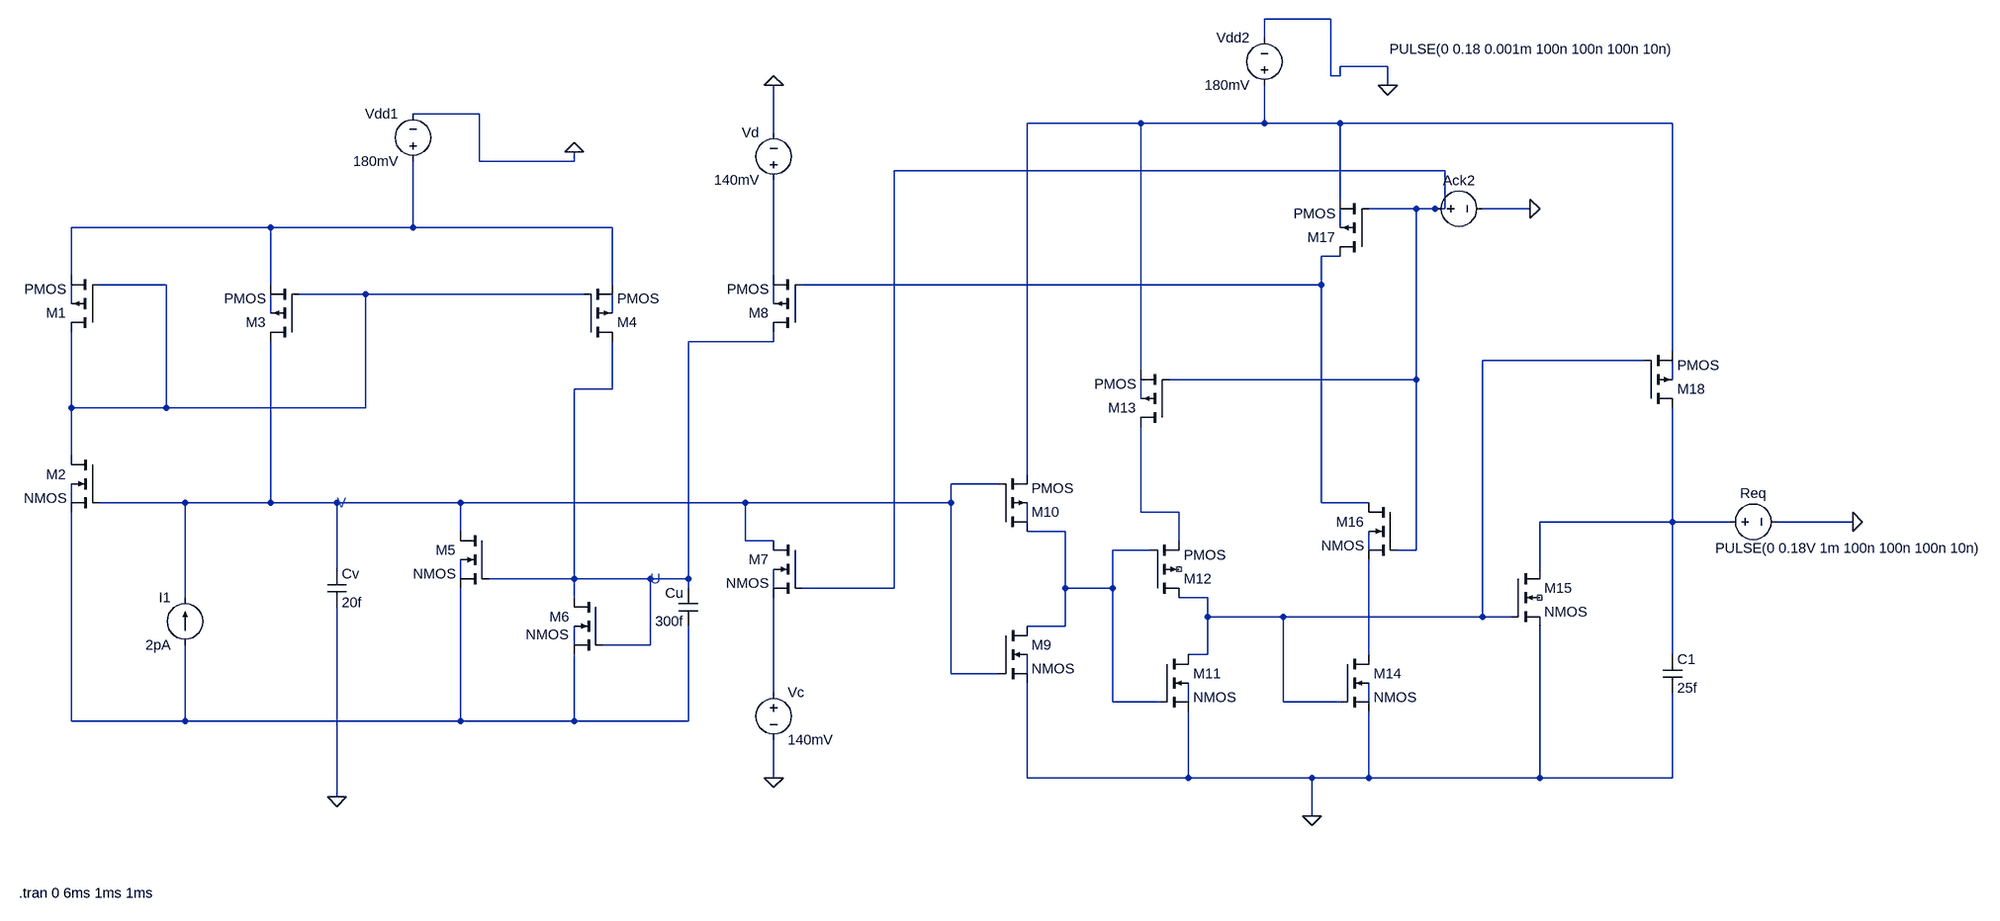
[diagram p0: schematic izhikevich_neurontemplatetest10.asc]
izhikevich_neurontemplatetest10.asc, the LTspice schematic file:
Version 4.1
SHEET 1 2428 1304
WIRE 1280 -240 1168 -240
WIRE 1168 -208 1168 -240
WIRE 1376 -160 1296 -160
WIRE 1280 -144 1280 -240
WIRE 1296 -144 1296 -160
WIRE 1296 -144 1280 -144
WIRE 1376 -128 1376 -160
WIRE -160 -80 -272 -80
WIRE 960 -64 768 -64
WIRE 1168 -64 1168 -128
WIRE 1168 -64 960 -64
WIRE 1296 -64 1168 -64
WIRE 1856 -64 1296 -64
WIRE 336 -48 336 -128
WIRE -160 0 -160 -80
WIRE 0 0 0 -16
WIRE 0 0 -160 0
WIRE 1472 16 544 16
WIRE 1296 64 1296 -64
WIRE 1424 80 1344 80
WIRE 1456 80 1424 80
WIRE 1472 80 1472 16
WIRE 1472 80 1456 80
WIRE 1616 80 1536 80
WIRE -512 112 -848 112
WIRE -272 112 -272 0
WIRE -272 112 -512 112
WIRE 64 112 -272 112
WIRE 1296 112 1296 80
WIRE 1296 160 1264 160
WIRE -848 192 -848 112
WIRE 336 192 336 32
WIRE -688 208 -800 208
WIRE -512 208 -512 112
WIRE 64 208 64 112
WIRE 1264 208 1264 160
WIRE 1264 208 384 208
WIRE -352 224 -464 224
WIRE 16 224 -352 224
WIRE -848 240 -848 208
WIRE 336 240 336 208
WIRE -512 256 -512 224
WIRE 64 256 64 224
WIRE 336 304 336 288
WIRE 336 304 192 304
WIRE 1856 320 1856 -64
WIRE 1808 336 1536 336
WIRE 960 352 960 -64
WIRE 1424 368 1424 80
WIRE 1424 368 1008 368
WIRE 1856 368 1856 336
WIRE 64 384 64 304
WIRE 64 384 0 384
WIRE 960 400 960 368
WIRE -848 416 -848 288
WIRE -688 416 -688 208
WIRE -688 416 -848 416
WIRE -352 416 -352 224
WIRE -352 416 -688 416
WIRE -848 496 -848 416
WIRE 768 528 768 -64
WIRE 720 544 640 544
WIRE -848 576 -848 544
WIRE -656 576 -800 576
WIRE -512 576 -512 304
WIRE -512 576 -656 576
WIRE -400 576 -512 576
WIRE -192 576 -400 576
WIRE 288 576 -192 576
WIRE 640 576 640 544
WIRE 640 576 288 576
WIRE 1264 576 1264 208
WIRE 1344 576 1264 576
WIRE 960 592 960 448
WIRE 1024 592 960 592
WIRE 768 608 768 576
WIRE 1856 608 1856 416
WIRE 1856 608 1632 608
WIRE 1952 608 1856 608
WIRE 2160 608 2032 608
WIRE -192 624 -192 576
WIRE 832 624 768 624
WIRE 288 640 288 576
WIRE 336 640 288 640
WIRE 1024 640 1024 592
WIRE 976 656 912 656
WIRE 1344 656 1344 624
WIRE 1424 656 1424 368
WIRE 1424 656 1392 656
WIRE -400 688 -400 576
WIRE 1632 688 1632 608
WIRE -192 704 -192 672
WIRE 0 704 0 384
WIRE 0 704 -144 704
WIRE 128 704 0 704
WIRE 192 704 192 304
WIRE 192 704 128 704
WIRE 192 720 192 704
WIRE 336 720 336 688
WIRE 544 720 544 16
WIRE 544 720 384 720
WIRE 832 720 832 624
WIRE 912 720 912 656
WIRE 912 720 832 720
WIRE -656 736 -656 576
WIRE 0 736 0 704
WIRE 1072 736 1024 736
WIRE 1072 768 1072 736
WIRE 1200 768 1072 768
WIRE 1536 768 1536 336
WIRE 1536 768 1200 768
WIRE 1584 768 1536 768
WIRE 832 784 832 720
WIRE 832 784 768 784
WIRE 0 816 0 784
WIRE 128 816 128 704
WIRE 128 816 48 816
WIRE 1072 832 1072 768
WIRE 1072 832 1040 832
WIRE 1344 832 1344 672
WIRE 1856 832 1856 608
WIRE 640 864 640 576
WIRE 720 864 640 864
WIRE 768 864 768 832
WIRE 336 896 336 736
WIRE 912 912 912 720
WIRE 992 912 912 912
WIRE 1040 912 1040 880
WIRE 1200 912 1200 768
WIRE 1296 912 1200 912
WIRE 1344 912 1344 880
WIRE -848 944 -848 592
WIRE -656 944 -656 816
WIRE -656 944 -848 944
WIRE -192 944 -192 720
WIRE -192 944 -656 944
WIRE 0 944 0 832
WIRE 0 944 -192 944
WIRE 192 944 192 784
WIRE 192 944 0 944
WIRE 336 1040 336 976
WIRE 768 1040 768 880
WIRE 1040 1040 1040 928
WIRE 1040 1040 768 1040
WIRE 1248 1040 1040 1040
WIRE 1344 1040 1344 928
WIRE 1344 1040 1248 1040
WIRE 1632 1040 1632 784
WIRE 1632 1040 1344 1040
WIRE 1856 1040 1856 896
WIRE 1856 1040 1632 1040
WIRE -400 1072 -400 752
WIRE 1248 1104 1248 1040
FLAG 0 -16 0
FLAG 336 -128 0
FLAG 1376 -128 0
FLAG 2160 608 0
FLAG 336 1040 0
FLAG -400 1072 0
FLAG 1248 1104 0
FLAG 1616 80 0
SYMBOL voltage 336 880 R0
WINDOW 123 0 0 Left 0
WINDOW 39 0 0 Left 0
SYMATTR InstName Vc
SYMATTR Value 140mV
SYMBOL current -656 816 R180
WINDOW 0 24 80 Left 2
WINDOW 3 24 0 Left 2
WINDOW 123 0 0 Left 0
WINDOW 39 0 0 Left 0
SYMATTR InstName I1
SYMATTR Value 2pA
SYMBOL voltage -272 16 R180
WINDOW 0 24 96 Left 2
WINDOW 3 24 16 Left 2
WINDOW 123 0 0 Left 0
WINDOW 39 0 0 Left 0
SYMATTR InstName Vdd1
SYMATTR Value 180mV
SYMBOL voltage 1168 -112 R180
WINDOW 0 24 96 Left 2
WINDOW 3 24 16 Left 2
WINDOW 123 0 0 Left 0
WINDOW 39 0 0 Left 0
SYMATTR InstName Vdd2
SYMATTR Value 180mV
SYMBOL voltage 336 48 R180
WINDOW 0 24 96 Left 2
WINDOW 3 24 16 Left 2
WINDOW 123 0 0 Left 0
WINDOW 39 0 0 Left 0
SYMATTR InstName Vd
SYMATTR Value 140mV
SYMBOL cap 208 720 M0
SYMATTR InstName Cu
SYMATTR Value 300f
SYMBOL cap -416 688 R0
SYMATTR InstName Cv
SYMATTR Value 20f
SYMBOL cap 1840 832 R0
SYMATTR InstName C1
SYMATTR Value 25f
SYMBOL voltage 1936 608 R270
WINDOW 0 32 56 VTop 2
WINDOW 3 -29 216 VBottom 2
WINDOW 123 0 0 Left 0
WINDOW 39 0 0 Left 0
SYMATTR InstName Req
SYMATTR Value PULSE(0 0.18V 1m 100n 100n 100n 10n)
SYMBOL voltage 1440 80 R270
WINDOW 0 32 56 VTop 2
WINDOW 3 285 179 VBottom 2
WINDOW 123 0 0 Left 0
WINDOW 39 0 0 Left 0
SYMATTR InstName Ack2
SYMATTR Value PULSE(0 0.18 0.001m 100n 100n 100n 10n)
SYMBOL nmos4 384 640 M0
SYMATTR InstName M7
SYMATTR Value2 l=175n w=350n
SYMBOL nmos4 48 736 M0
WINDOW 3 58 62 Left 2
SYMATTR InstName M6
SYMATTR Value2 l=700n w=150n
SYMBOL nmos4 -144 624 M0
SYMATTR InstName M5
SYMATTR Value2 l=400n w=600n
SYMBOL nmos4 -800 496 M0
SYMATTR InstName M2
SYMATTR Value2 l=300n w=125n
SYMBOL pmos4 1008 448 R180
SYMATTR InstName M13
SYMATTR Value2 l=200n w=100n
SYMBOL pmos4 384 288 R180
SYMATTR InstName M8
SYMATTR Value2 l=1.3u w=125n
SYMBOL pmos4 16 304 M180
SYMATTR InstName M4
SYMATTR Value2 l=650n w=90n
SYMBOL pmos4 -464 304 R180
SYMATTR InstName M3
SYMATTR Value2 l=300n w=125n
SYMBOL pmos4 -800 288 R180
SYMATTR InstName M1
SYMATTR Value2 l=300n w=125n
SYMBOL pmos4 720 624 M180
SYMATTR InstName M10
SYMATTR Value2 l=1u w=100n
SYMBOL pmos4 976 736 M180
SYMATTR InstName M12
SYMATTR Value2 l=100n w=100n
SYMBOL pmos4 1808 416 M180
SYMATTR InstName M18
SYMATTR Value2 l=200n w=100n
SYMBOL nmos4 720 784 R0
SYMATTR InstName M9
SYMATTR Value2 l=100n w=100n
SYMBOL nmos4 992 832 R0
SYMATTR InstName M11
SYMATTR Value2 l=1u w=100n
SYMBOL pmos4 1344 160 R180
SYMATTR InstName M17
SYMATTR Value2 l=100n w=100n
SYMBOL nmos4 1392 576 M0
SYMATTR InstName M16
SYMATTR Value2 l=100n w=100n
SYMBOL nmos4 1296 832 R0
SYMATTR InstName M14
SYMATTR Value2 l=100n w=100n
SYMBOL nmos4 1584 688 R0
SYMATTR InstName M15
SYMATTR Value2 l=100n w=250n
TEXT 128 704 Left 2 ;U
TEXT -400 576 Left 2 ;V
TEXT -936 1256 Left 2 !.tran 0 6ms 1ms 1ms

The netlist it stands for:
* izhikevich_neurontemplatetest10.asc
Vc N028 0 140mV
I1 N031 N016 2pA
Vdd1 N003 0 180mV
Vdd2 N001 0 180mV
Vd N006 0 140mV
Cu N012 N031 300f
Cv N016 0 20f
C1 N020 0 25f
V§Req N020 0 PULSE(0 0.18V 1m 100n 100n 100n 10n)
V§Ack2 N002 0 PULSE(0 0.18 0.001m 100n 100n 100n 10n)
M7 N016 N002 N028 N024 NMOS l=175n w=350n
M6 N012 N012 N031 N025 NMOS l=700n w=150n
M5 N016 N012 N031 N023 NMOS l=400n w=600n
M2 N007 N016 N031 N017 NMOS l=300n w=125n
M13 N018 N002 N001 N015 PMOS l=200n w=100n
M8 N012 N005 N006 N009 PMOS l=1.3u w=125n
M4 N012 N007 N003 N011 PMOS l=650n w=90n
M3 N016 N007 N003 N010 PMOS l=300n w=125n
M1 N007 N007 N003 N008 PMOS l=300n w=125n
M10 N021 N016 N001 N019 PMOS l=1u w=100n
M12 N013 N021 N018 NC_01 PMOS l=100n w=100n
M18 N020 N013 N001 N014 PMOS l=200n w=100n
M9 N021 N016 0 N027 NMOS l=100n w=100n
M11 N013 N021 0 N029 NMOS l=1u w=100n
M17 N005 N002 N001 N004 PMOS l=100n w=100n
M16 N005 N002 N026 N022 NMOS l=100n w=100n
M14 N026 N013 0 N030 NMOS l=100n w=100n
M15 N020 N013 0 NC_02 NMOS l=100n w=250n
.model NMOS NMOS
.model PMOS PMOS
.lib standard.mos
* U
* V
.tran 0 6ms 1ms 1ms
.backanno
.end